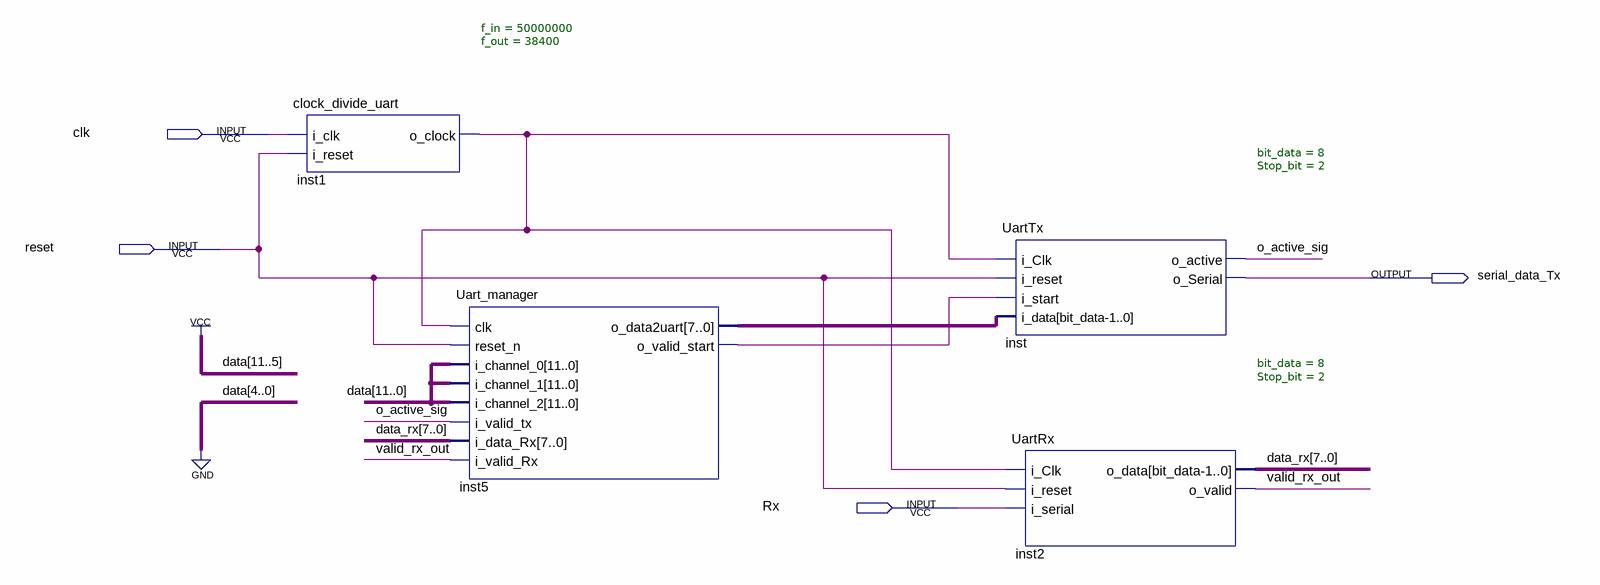
[diagram p0: schematic sheet]
// Quartus schematic test_uart.bdf as structural Verilog: 4 symbols, 4 pins
module test_uart (
  input  clk,
  input  reset,
  input  Rx,
  output serial_data_Tx
);

  wire inst1_o_clock, inst5_o_valid_start, o_active_sig, valid_rx_out;
  wire [7:0] data_rx, inst5_o_data2uart;

  clock_divide_uart #(.f_in(50000000), .f_out(38400)) inst1 (.i_clk(clk), .i_reset(reset), .o_clock(inst1_o_clock));
  Uart_manager inst5 (
    .clk(inst1_o_clock), .reset_n(reset), .i_channel_0(12'b111111100000), .i_channel_1(12'b111111100000),
    .i_channel_2(12'b111111100000), .i_valid_tx(o_active_sig), .i_data_Rx(data_rx),
    .i_valid_Rx(valid_rx_out), .o_data2uart(inst5_o_data2uart), .o_valid_start(inst5_o_valid_start));
  UartTx #(.bit_data(8), .Stop_bit(2)) inst (
    .i_Clk(inst1_o_clock), .i_reset(reset), .i_start(inst5_o_valid_start), .i_data(inst5_o_data2uart),
    .o_active(o_active_sig), .o_Serial(serial_data_Tx));
  UartRx #(.bit_data(8), .Stop_bit(2)) inst2 (
    .i_Clk(inst1_o_clock), .i_reset(reset), .i_serial(Rx), .o_data(data_rx), .o_valid(valid_rx_out));
endmodule
